# EAGLE design hmwk2 (EAGLE 7.7.0)
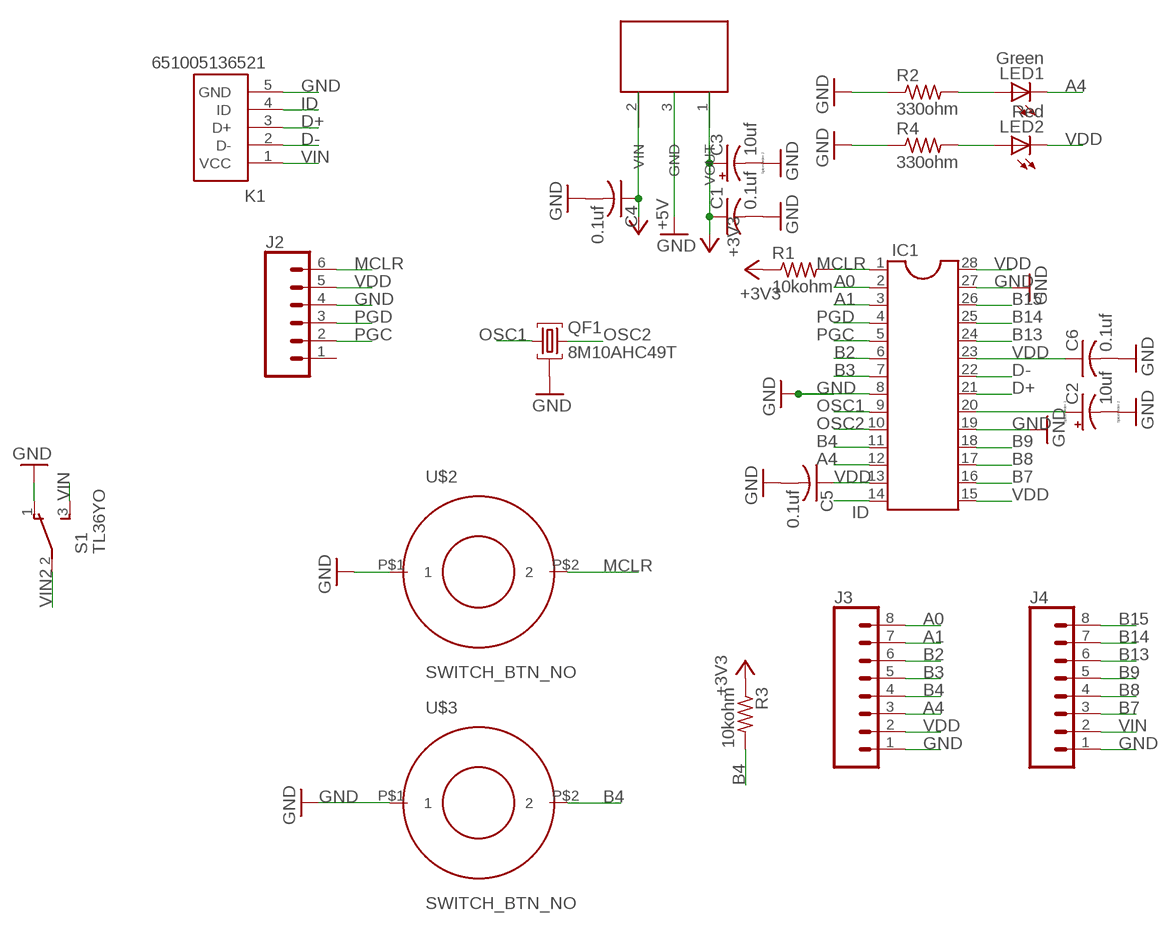
[diagram p0: schematic, sheet 1]

## Parts
C1  0.1uf  C-US025-025X050  [C025-025X050]
C2  10uf  CPOL-USE5-5  [E5-5]
C3  10uf  CPOL-USE5-5  [E5-5]
C4  0.1uf  C-US025-025X050  [C025-025X050]
C5  0.1uf  C-US025-025X050  [C025-025X050]
C6  0.1uf  C-US025-025X050  [C025-025X050]
IC1  DIL28-3  [DIL28-3]
J2  CONN_06SILK_FEMALE_PTH  [1X06]
J3  CONN_08"  [1X08]
J4  CONN_08"  [1X08]
K1  651005136521  [651005136521]
LED1  Green  LED3MM  [LED3MM]
LED2  Red  LED3MM  [LED3MM]
QF1  8M10AHC49T  [HC49U]
R1  10kohm  R-US_0207/10  [0207/10]
R2  330ohm  R-US_0207/10  [0207/10]
R3  10kohm  R-US_0207/10  [0207/10]
R4  330ohm  R-US_0207/10  [0207/10]
S1  TL36YO  [TL3XYO]
U$1  TO92  [TO92]
U$2  SWITCH_BTN_NO  [BTN_2]
U$3  SWITCH_BTN_NO  [BTN_2]

## Nets
+3V3: C1.1 C3.+ R1.1 R3.1 U$1.1(VOUT)
A0: IC1.2 J3.8
A1: IC1.3 J3.7
A4: IC1.12 J3.3 LED1.K(C)
B2: IC1.6 J3.6
B3: IC1.7 J3.5
B4: IC1.11 J3.4 R3.2 U$3.P$2
B7: IC1.16 J4.3
B8: IC1.17 J4.4
B9: IC1.18 J4.5
B13: IC1.24 J4.6
B14: IC1.25 J4.7
B15: IC1.26 J4.8
D+: IC1.21 K1.3(D+)
D-: IC1.22 K1.2(D-)
GND: C1.2 C2.- C3.- C4.2 C5.2 C6.2 IC1.8 IC1.19 IC1.27 J2.4 J3.1 J4.1 K1.5(GND) QF1.2 R2.1 R4.1 S1.1(O) U$1.3(GND) U$2.P$1 U$3.P$1
ID: IC1.14 K1.4(ID)
MCLR: IC1.1 J2.6 R1.2 U$2.P$2
N$1: LED1.A R2.2
N$2: C2.+ IC1.20
N$3: LED2.A R4.2
OSC1: IC1.9 QF1.1
OSC2: IC1.10 QF1.3
PGC: IC1.5 J2.2
PGD: IC1.4 J2.3
VDD: C5.1 C6.1 IC1.13 IC1.15 IC1.23 IC1.28 J2.5 J3.2 LED2.K(C)
VIN: J4.2 K1.1(VCC) S1.3(S)
VIN2: C4.1 S1.2(P) U$1.2(VIN) ; supply symbol labelled +5V
Unconnected: J2.1

## Library data of the parts
C1 C4-C6 = components:C-US: CAPACITOR, American symbol
C2 C3 = components:CPOL-US: POLARIZED CAPACITOR, American symbol
IC1 = components:DIL28: Dual In Line
J2 = components:CONN_06: Multi connection point. Often used as Generic Header-pin footprint for 0.1 inch spaced/style header connections On any of the 0.1 inch spaced packages, you can populate with these: Break Away Headers - Straight <https://www.sparkfun.com/products/116> (PRT-00116) Break Away Male Headers - Right Angle <https://www.sparkfun.com/products/553> (PRT-00553) Female Headers <https://www.sparkfun.com/products/115> (PRT-00115) Break Away Headers - Machine Pin <https://www.sparkfun.com/products/117> (PRT-00117) Break Away Female Headers - Swiss Machine Pin <https://www.sparkfun.com/products/743> (PRT-00743) Arduino Stackable Header - 6 Pin <https://www.sparkfun.com/products/9280> (PRT-09280) For SCREWTERMINALS and SPRING TERMINALS visit here: Screw Terimnals on SparkFun.com <https://www.sparkfun.com/search/results?term=Screw+Terminals> (5mm/3.5mm/2.54mm spacing) This device is also useful as a general connection point to wire up your design to another part of your project. Our various solder wires solder well into these plated through hole pads. Hook-Up Wire - Assortment (Stranded, 22 AWG) <https://www.sparkfun.com/products/11375> (PRT-11375) Hook-Up Wire - Assortment (Solid Core, 22 AWG) <https://www.sparkfun.com/products/11367> (PRT-11367) View the entire wire category on our website here <https://www.sparkfun.com/categories/141>; PROD_ID: CONN-08437
J3 J4 = components:CONN_08: Multi connection point. Often used as Generic Header-pin footprint for 0.1 inch spaced/style header connections On any of the 0.1 inch spaced packages, you can populate with these: Break Away Headers - Straight <https://www.sparkfun.com/products/116> (PRT-00116) Break Away Male Headers - Right Angle <https://www.sparkfun.com/products/553> (PRT-00553) Female Headers <https://www.sparkfun.com/products/115> (PRT-00115) Break Away Headers - Machine Pin <https://www.sparkfun.com/products/117> (PRT-00117) Break Away Female Headers - Swiss Machine Pin <https://www.sparkfun.com/products/743> (PRT-00743) Arduino Stackable Header - 8 Pin <https://www.sparkfun.com/products/9279> (PRT-09279) For SCREWTERMINALS and SPRING TERMINALS visit here: Screw Terimnals on SparkFun.com <https://www.sparkfun.com/search/results?term=Screw+Terminals> (5mm/3.5mm/2.54mm spacing) This device is also useful as a general connection point to wire up your design to another part of your project. Our various solder wires solder well into these plated through hole pads. Hook-Up Wire - Assortment (Stranded, 22 AWG) <https://www.sparkfun.com/products/11375> (PRT-11375) Hook-Up Wire - Assortment (Solid Core, 22 AWG) <https://www.sparkfun.com/products/11367> (PRT-11367) View the entire wire category on our website here <https://www.sparkfun.com/categories/141> Special notes: Molex polarized connector foot print use with SKU : PRT-08231 with associated crimp pins and housings. 1MM SMD Version SKU: PRT-10208 NOTES ON THE VARIANTS LOCK and LOCK_LONGPADS... This footprint was designed to help hold the alignment of a through-hole component (i.e. 6-pin header) while soldering it into place. You may notice that each hole has been shifted either up or down by 0.005 of an inch from it's more standard position (which is a perfectly straight line). This slight alteration caused the pins (the squares in the middle) to touch the edges of the holes. Because they are alternating, it causes a "brace" to hold the component in place. 0.005 has proven to be the perfect amount of "off-center" position when using our standard breakaway headers. Although looks a little odd when you look at the bare footprint, once you have a header in there, the alteration is very hard to notice. Also,if you push a header all the way into place, it is covered up entirely on the bottom side.; PROD_ID: CONN-08438
K1 = components:651005136521: WR-COM Horizontal 5 Contacts Mini USB Typ B
LED1 LED2 = components:LED: LED OSRAM: - CHIPLED LG R971, LG N971, LY N971, LG Q971, LY Q971, LO R971, LY R971 LH N974, LH R974 LS Q976, LO Q976, LY Q976 LO Q996 - Hyper CHIPLED LW Q18S LB Q993, LB Q99A, LB R99A - SideLED LS A670, LO A670, LY A670, LG A670, LP A670 LB A673, LV A673, LT A673, LW A673 LH A674 LY A675 LS A676, LA A676, LO A676, LY A676, LW A676 LS A679, LY A679, LG A679 - Hyper Micro SIDELED® LS Y876, LA Y876, LO Y876, LY Y876 LT Y87S - SmartLED LW L88C, LW L88S LB L89C, LB L89S, LG L890 LS L89K, LO L89K, LY L89K LS L896, LA L896, LO L896, LY L896 - TOPLED LS T670, LO T670, LY T670, LG T670, LP T670 LSG T670, LSP T670, LSY T670, LOP T670, LYG T670 LG T671, LOG T671, LSG T671 LB T673, LV T673, LT T673, LW T673 LH T674 LS T676, LA T676, LO T676, LY T676, LB T676, LH T676, LSB T676, LW T676 LB T67C, LV T67C, LT T67C, LS T67K, LO T67K, LY T67K, LW E67C LS E67B, LA E67B, LO E67B, LY E67B, LB E67C, LV E67C, LT E67C LW T67C LS T679, LY T679, LG T679 LS T770, LO T770, LY T770, LG T770, LP T770 LB T773, LV T773, LT T773, LW T773 LH T774 LS E675, LA E675, LY E675, LS T675 LS T776, LA T776, LO T776, LY T776, LB T776 LHGB T686 LT T68C, LB T68C - Hyper Mini TOPLED® LB M676 - Mini TOPLED Santana® LG M470 LS M47K, LO M47K, LY M47K Source: http://www.osram.convergy.de LUXEON: - LUMILED® LXK2-PW12-R00, LXK2-PW12-S00, LXK2-PW14-U00, LXK2-PW14-V00 LXK2-PM12-R00, LXK2-PM12-S00, LXK2-PM14-U00 LXK2-PE12-Q00, LXK2-PE12-R00, LXK2-PE12-S00, LXK2-PE14-T00, LXK2-PE14-U00 LXK2-PB12-K00, LXK2-PB12-L00, LXK2-PB12-M00, LXK2-PB14-N00, LXK2-PB14-P00, LXK2-PB14-Q00 LXK2-PR12-L00, LXK2-PR12-M00, LXK2-PR14-Q00, LXK2-PR14-R00 LXK2-PD12-Q00, LXK2-PD12-R00, LXK2-PD12-S00 LXK2-PH12-R00, LXK2-PH12-S00 LXK2-PL12-P00, LXK2-PL12-Q00, LXK2-PL12-R00 Source: www.luxeon.com KINGBRIGHT: KA-3528ASYC Source: www.kingbright.com
QF1 = components:8M10AHC49T: Monolithic Crystal Filters Source: www.vanlong.com; OC_FARNELL: unknown; OC_NEWARK: unknown
R1-R4 = components:R-US_: RESISTOR, American symbol
S1 = components:TL36YO: TINY SWITCH ON - ON Source: http://www2.produktinfo.conrad.com/datenblaetter/700000-724999/705152-da-01-de-Subminiaturschalter_TL_36YO.pdf
U$1 = components:TO92
U$2 U$3 = components:SWITCH_BTN_NO

## Board
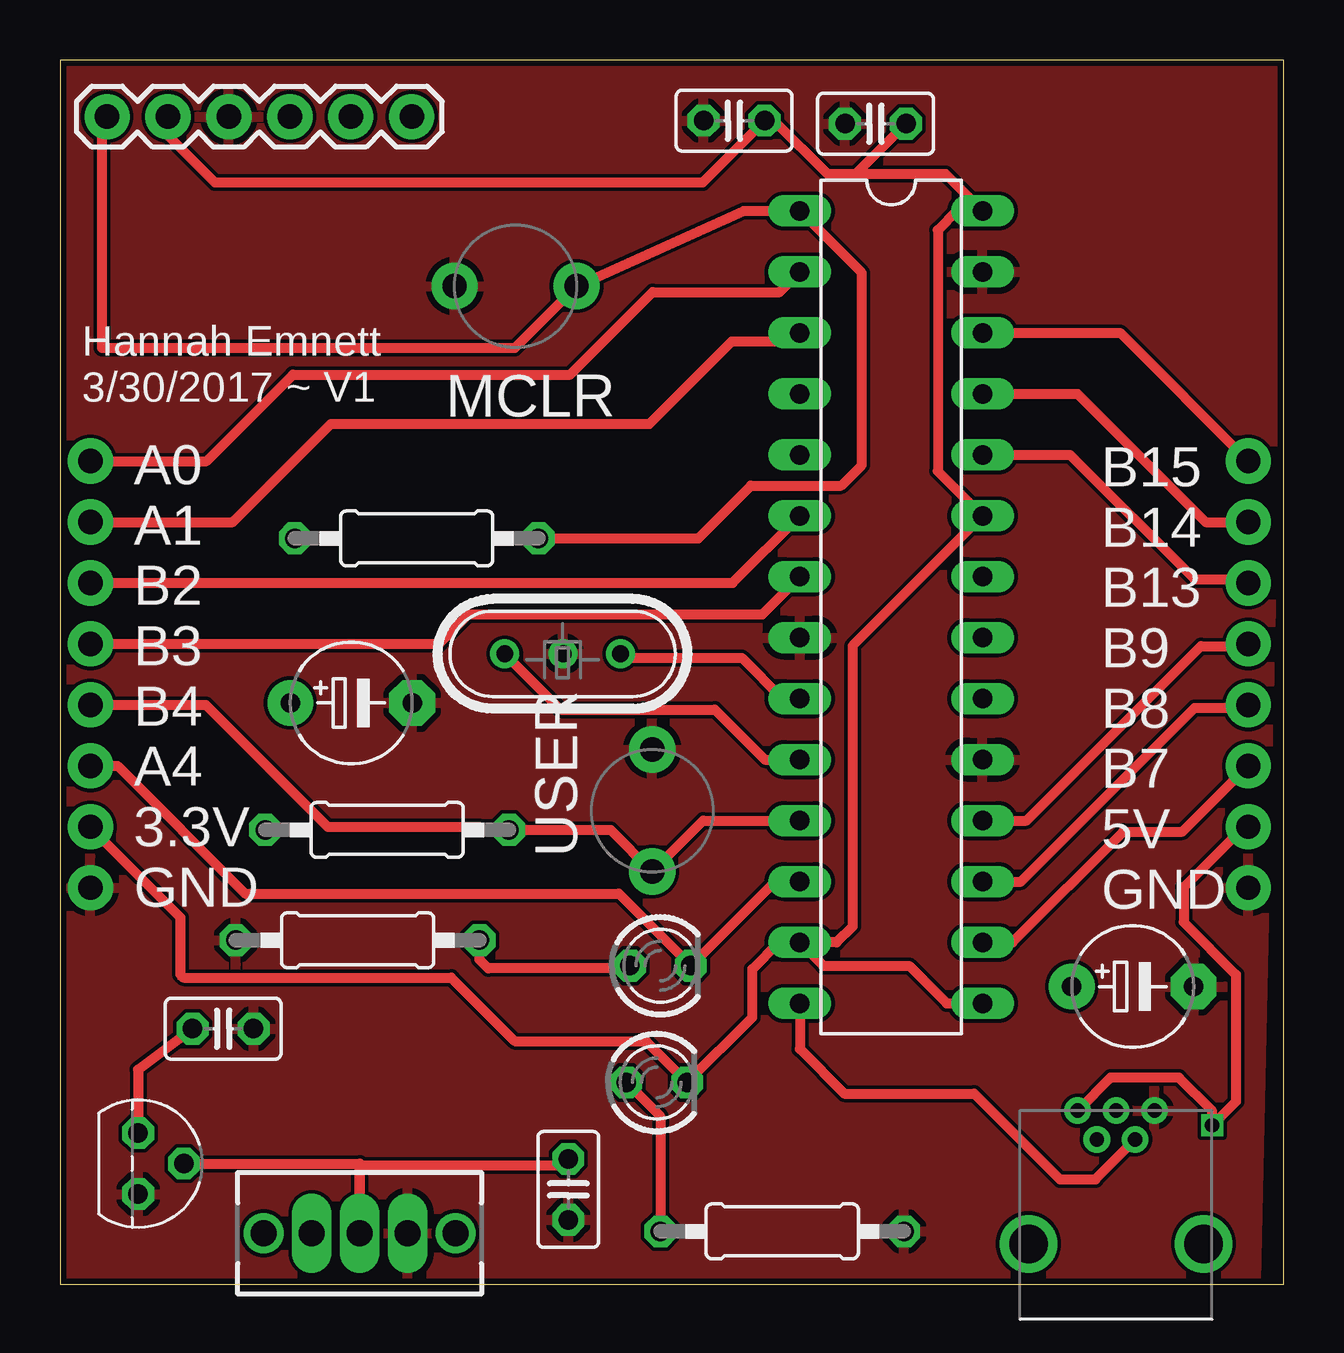
[diagram p1: board, top side]
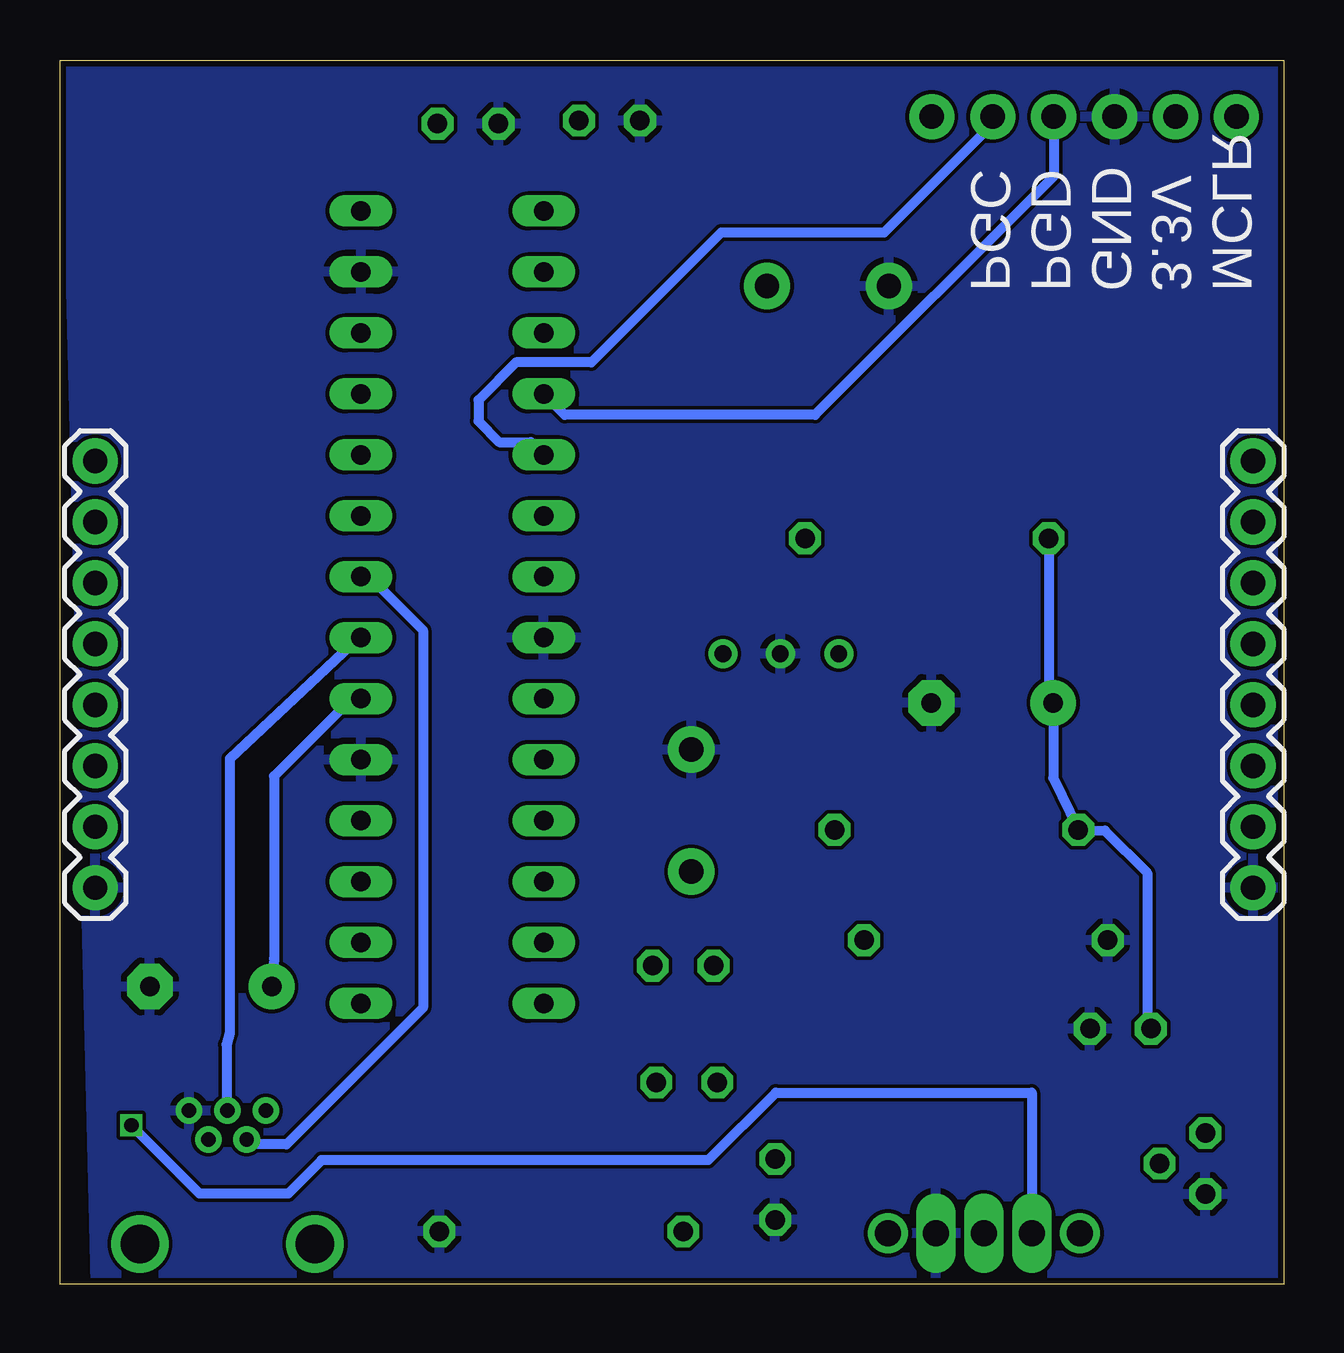
[diagram p2: board, bottom side, seen from below]

Size 51 x 51 mm. Coordinates in mm from the lower left corner, seen from the top.
Outline: 0,0 51,0 51,51 0,51 0,0
Copper layers (1*16): Top 0.035mm / dielectric 1.5mm / Bottom 0.035mm
Design rules "seeed": minimum track width 6mil, minimum drill 12mil, track to track 6mil, track to pad 6mil, pad to pad 6mil, via to via 6mil, smd to smd 0mil, copper to edge 10mil, drill to drill 10mil, minimum pad ring 10mil, minimum via ring 6mil, stop-mask expansion 2mil, vias tented up to drill 100mil, thermal gap 10mil

### Footprints (pad centres in the part's own frame; a part is rotated, then mirrored left to right if it is on the bottom)
C025-025X050 = drill 0.813 octagon: 1 -1.27,0; 2 1.27,0
E5-5 = drill 0.813 pad 1.905: + -2.54,0 | drill 0.813 pad 1.905 octagon: - 2.54,0
DIL28-3 = drill 0.813 long: 1 -16.51,-3.81; 2 -13.97,-3.81; 3 -11.43,-3.81; 4 -8.89,-3.81; 5 -6.35,-3.81; 6 -3.81,-3.81; 7 -1.27,-3.81; 8 1.27,-3.81; 9 3.81,-3.81; 10 6.35,-3.81; 11 8.89,-3.81; 12 11.43,-3.81; 13 13.97,-3.81; 14 16.51,-3.81; 15 16.51,3.81; 16 13.97,3.81; 17 11.43,3.81; 18 8.89,3.81; 19 6.35,3.81; 20 3.81,3.81; 21 1.27,3.81; 22 -1.27,3.81; 23 -3.81,3.81; 24 -6.35,3.81; 25 -8.89,3.81; 26 -11.43,3.81; 27 -13.97,3.81; 28 -16.51,3.81
1X06 = drill 1.016 pad 1.88: 1 0,0; 2 2.54,0; 3 5.08,0; 4 7.62,0; 5 10.16,0; 6 12.7,0
1X08 = drill 1.016 pad 1.88: 1 0,0; 2 2.54,0; 3 5.08,0; 4 7.62,0; 5 10.16,0; 6 12.7,0; 7 15.24,0; 8 17.78,0
651005136521 = drill 0.6: 1 1.6,-0.9; 2 0.8,0.3; 3 0,-0.9; 4 -0.8,0.3; 5 -1.6,-0.9 | drill 1.6: 7 -3.65,4.65; 8 3.65,4.65
LED3MM = drill 0.813 octagon: A -1.27,0; K 1.27,0
HC49U = drill 0.7 pad 1.2: 1 -2.413,0; 2 -0.027,0; 3 2.413,0
0207/10 = drill 0.813 octagon: 1 -5.08,0; 2 5.08,0
TL3XYO = drill 1.1 pad 1.422 long: 1 -2,0; 2 0,0; 3 2,0 | drill 1.1 pad 1.676: M1 -4,0; M2 4,0
TO92 = drill 0.813 octagon: 1 -1.27,0; 2 0,1.905; 3 1.27,0
BTN_2 = drill 1.016 pad 1.93: P$1 -2.54,0; P$2 2.54,0

### Placement (x,y rotation side)
C1  6.8,10.64 0 top
C2  44.71,12.4 0 top
C3  12.14,24.21 0 top
C4  21.19,3.94 270 top
C5  28.1,48.47 180 top
C6  33.99,48.34 180 top
IC1  34.65,28.2 270 top
J2  14.66,48.64 180 top
J3  1.27,16.51 90 bottom
J4  49.53,16.51 90 bottom
K1  44.02,6.32 180 top
LED1  25.03,13.26 0 top
LED2  24.88,8.4 0 top
QF1  20.95,26.26 180 top
R1  14.87,31.07 0 top
R2  12.41,14.32 0 top
R3  13.64,18.92 0 top
R4  30.1,2.19 180 top
S1  12.49,2.12 180 top
U$1  3.26,5.02 270 top
U$2  18.99,41.58 0 top
U$3  24.69,19.73 270 top

### Tracks (layer width: path | path; a pad name or v marks a point on that pad's centre or on a via)
+3V3
  Top 0.406: C1.1 3.26,8.93 U$1.1
  Bottom 0.406: R1.1 9.79,24.4 C3.+ 9.6,21.08 R3.1 7.45,18.89 5.68,17.13 5.68,10.79 C1.1
A0
  Top 0.406: J3.8 6.11,34.29 9.71,37.89 21.27,37.89 24.7,41.33 30,41.33 IC1.2
A1
  Top 0.406: J3.7 7.2,31.75 11.29,35.84 24.57,35.84 28.01,39.28 30.49,39.28 IC1.3
A4
  Top 0.406: IC1.12 29.8,16.77 LED1.K 23.29,16.27 7.73,16.27 2.4,21.59 J3.3
B2
  Top 0.406: J3.6 28.04,29.21 IC1.6
B3
  Top 0.406: J3.5 15.81,26.67 17.04,27.91 29.27,27.91 IC1.7
B4
  Top 0.406: IC1.11 26.81,19.31 U$3.P$2 22.95,18.92 R3.2 17.48,19.04 11.16,19.04 6.08,24.13 J3.4
B7
  Top 0.406: IC1.16 39.7,14.23 44.32,18.85 46.79,18.85 J4.3
B8
  Top 0.406: IC1.17 40.06,16.77 47.29,24 49.4,24 J4.4
B9
  Top 0.406: IC1.18 40.28,19.31 47.56,26.58 49.44,26.58 J4.5
B13
  Top 0.406: IC1.24 42.1,34.55 47.29,29.36 49.38,29.36 J4.6
B14
  Top 0.406: IC1.25 42.41,37.09 47.76,31.74 J4.7
B15
  Top 0.406: IC1.26 44.19,39.63 J4.8
D+
  Bottom 0.406: IC1.21 38.55,26.93 43.92,21.89 43.92,10.45 44.06,9.98 44.06,7.26 K1.3
D-
  Bottom 0.406: IC1.22 38.1,29.47 35.87,27.24 35.87,11.5 41.55,5.82 43.01,5.82 K1.2
GND
  pour Top: 0,50.72 50.96,50.69 49.84,0.1 0,0
  pour Bottom: 0,50.59 50.78,50.79 49.53,0 0,0
ID
  Top 0.406: IC1.14 30.84,9.79 32.7,7.93 38.11,7.93 41.68,4.36 43.16,4.36 K1.4
MCLR
  Top 0.406: R1.2 26.61,31.07 28.8,33.26 32.56,33.26 33.42,34.12 33.42,42.12 IC1.1 28.51,44.71 U$2.P$2 18.96,39.01 1.74,39.01 1.74,48.64 J2.6
N$1
  Top 0.406: LED1.A 23.64,13.15 17.85,13.15 17.49,13.51 R2.2
N$2
  Bottom 0.406: IC1.20 38.85,24.39 42.08,21.16 42.08,13.55 C2.+
N$3
  Top 0.406: LED2.A 25.02,6.98 R4.2
OSC1
  Top 0.406: QF1.1 23.53,26.09 28.42,26.09 30.12,24.39 IC1.9
OSC2
  Top 0.406: QF1.3 20.86,23.93 27.29,23.93 29.38,21.85 IC1.10
PGC
  Bottom 0.406: J2.2 12.12,48.34 16.65,43.81 23.44,43.81 28.85,38.4 31.99,38.4 33.56,36.83 33.56,35.95 32.69,35.08 31.37,35.08 IC1.5
PGD
  Bottom 0.406: J2.3 9.58,46.16 19.53,36.22 29.96,36.22 IC1.4
VDD
  Top 0.406: IC1.13 32.37,14.23 33.04,14.89 33.04,26.59 IC1.23 36.59,33.87 36.59,43.91 37.4,44.71 IC1.28 36.91,46.25 33.17,46.25 | IC1.13 31.82,13.25 35.4,13.25 36.96,11.69 IC1.15 | IC1.13 29.96,14.23 28.86,13.12 28.86,11.11 LED2.K 24.43,10.12 18.96,10.12 16.31,12.76 5.15,12.76 5.02,12.89 5.02,15.28 1.27,19.02 J3.2 | J2.5 4.5,47.85 6.45,45.9 26.8,45.9 C5.1 29.77,48.47 31.99,46.25 33.17,46.25 | 33.17,46.25 C6.1
VIN  (via drill 0.6)
  Top 0.406: K1.1 43.79,8.6 46.64,8.6 48.03,7.21 v48.03,6.61 49.02,7.6 49.02,12.89 46.84,15.07 46.84,16.53 49.36,19.05 J4.2
  Bottom 0.406: v48.03,6.61 45.19,3.77 41.49,3.77 40.1,5.16 23.98,5.16 21.17,7.97 10.49,7.97 S1.3
VIN2
  Top 0.406: U$1.2 12.49,5.02 S1.2 12.49,4.95 21.19,4.95 C4.1

### Text on the board
tNames: Hannah Emnett / 3/30/2017 ~ V1 | MCLR | USER | A0 / A1 / B2 / B3 / B4 / A4 / 3.3V / GND | B15 / B14 / B13 / B9 / B8 / B7 / 5V / GND
bNames: MCLR / 3.3V / GND / PGD / PGC
tDocu: ON